# EAGLE design rgb v2.0 (EAGLE 6.5.0)
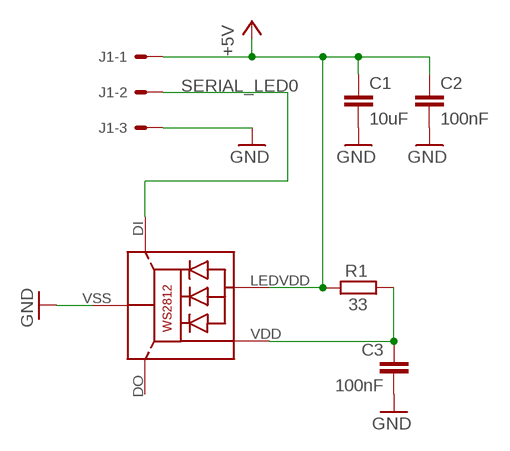
[diagram p0: schematic, sheet 1]

## Parts
C1  10uF  C-EUC0603  [C0603]
C2  100nF  C-EUC0402  [C0402]
C3  100nF  C-EUC0402  [C0402]
J1  22-05-7038-03  [7395-03]
LED1  WS2812LARGER  [WS2812_LARGER]
R1  33  R-EU_R0402  [R0402]

## Nets
+5V: C1.1 C2.1 J1.1 LED1.LEDVDD R1.2
GND: C1.2 C2.2 C3.2 J1.3 LED1.VSS(GND)
N$6 [power]: C3.1 LED1.VDD R1.1
SERIAL_LED0: J1.2 LED1.DI
Unconnected: LED1.DO

## Library data of the parts
C1-C3 = rcl:C-EU: CAPACITOR, European symbol
J1 = con-molex:22-?-03: CONNECTOR wire to board 2.54 mm (.1 inch) pitch header; OC_FARNELL: unknown; OC_NEWARK: unknown
LED1 = CNP-miscellaneous:WS2812
R1 = rcl:R-EU_: RESISTOR, European symbol

## Net classes
1 power: width 0.381 mm

## Board
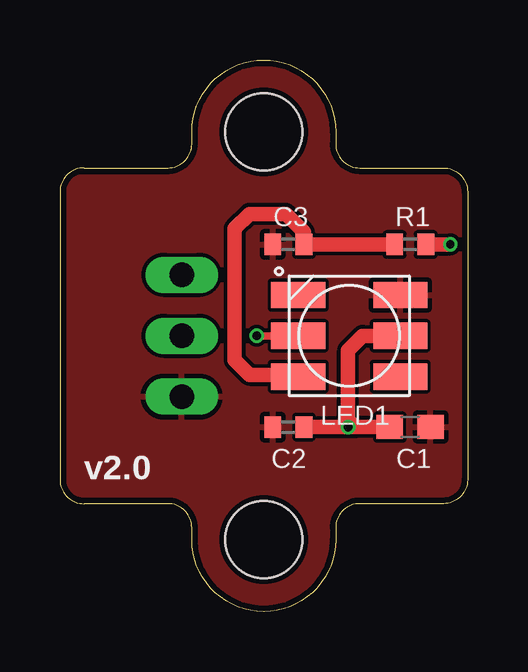
[diagram p1: board, top side]
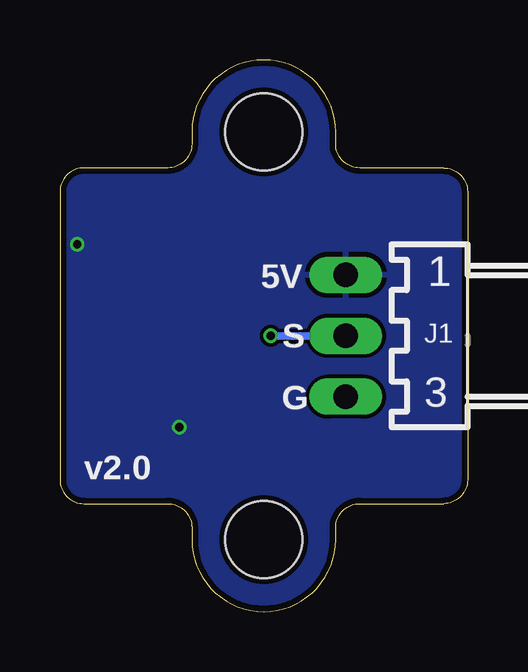
[diagram p2: board, bottom side, seen from below]

Size 17 x 23 mm. Coordinates in mm from the lower left corner, seen from the top.
Outline: 1,18.5 arc90 0,17.5 0,5.5 arc90 1,4.5 4.5,4.5 arc-90 5.5,3.5 5.5,3 arc90 8.5,0 arc90 11.5,3 11.5,3.5 arc-90 12.5,4.5 16,4.5 arc90 17,5.5 17,17.5 arc90 16,18.5 12.5,18.5 arc-90 11.5,19.5 11.5,20 arc90 8.5,23 arc90 5.5,20 5.5,19.5 arc-90 4.5,18.5 1,18.5
Copper layers (1*16): Top 0.018mm / dielectric 1.55mm / Bottom 0.018mm
Design rules "eC_2Layer_PClass6_BaseCopperO18_eCDefault": minimum track width 0.15mm, minimum drill 0.35mm, track to track 0.15mm, track to pad 0.15mm, pad to pad 0.15mm, via to via 0.15mm, smd to smd 0mil, copper to edge 0.25mm, drill to drill 0.35mm, minimum pad ring 0.175mm, minimum via ring 0.125mm, stop-mask expansion 0mil, vias tented up to drill 0.45mm, thermal gap 0.2mm
Holes 3.2 mm at 8.5,3 8.5,20

### Footprints (pad centres in the part's own frame; a part is rotated, then mirrored left to right if it is on the bottom)
C0603 = smd 1.1 x 1: 1 -0.85,0; 2 0.85,0
C0402 = smd 0.7 x 0.9: 1 -0.65,0; 2 0.65,0
7395-03 = drill 1.016 long: 1 2.54,0; 2 0,0; 3 -2.54,0
WS2812_LARGER = smd 2.254 x 1.1: DI 2.127,0; DO 2.127,-1.7; LEDVDD -2.127,0; NC -2.127,1.7; VDD 2.127,1.7; VSS -2.127,-1.7
R0402 = smd 0.7 x 0.9: 1 -0.65,0; 2 0.65,0

### Placement (x,y rotation side)
C1  14.61,7.69 0 top
C2  9.53,7.69 180 top
C3  9.53,15.31 180 top
J1  5.08,11.5 90 bottom
LED1  12.06,11.5 180 top
R1  14.61,15.31 0 top

### Tracks (layer width: path | path; a pad name or v marks a point on that pad's centre or on a via)
+5V  (via drill 0.35)
  Top 0.61: R1.2 v16.28,15.31 | C2.1 11.71,7.69 | 11.71,7.69 v12.01,7.69 | v12.01,7.69 12.01,8 | 12.01,8 12.01,10.89 12.62,11.5 LED1.LEDVDD | C1.1 12.32,7.69 | 12.32,7.69 v12.01,7.69 | 11.71,7.69 12.01,8 | 12.01,8 12.32,7.69
  pour Bottom: 0,0 0,23 17,23 17,0
GND
  pour Top: 0,0 0,23 17,23 17,0
N$6
  Top 0.61: R1.1 C3.1 10.18,15.83 9.42,16.58 7.9,16.58 7.29,15.97 7.29,10.48 7.9,9.87 9.86,9.87 LED1.VDD
SERIAL_LED0  (via drill 0.35)
  Top 0.305: v8.2,11.5 LED1.DI
  Bottom 0.305: J1.2 v8.2,11.5

### Text on the board
tPlace: v2.0
bPlace: 5V | S | G | v2.0